# EAGLE design TM_Programmer0.1 (EAGLE 7.5.0)
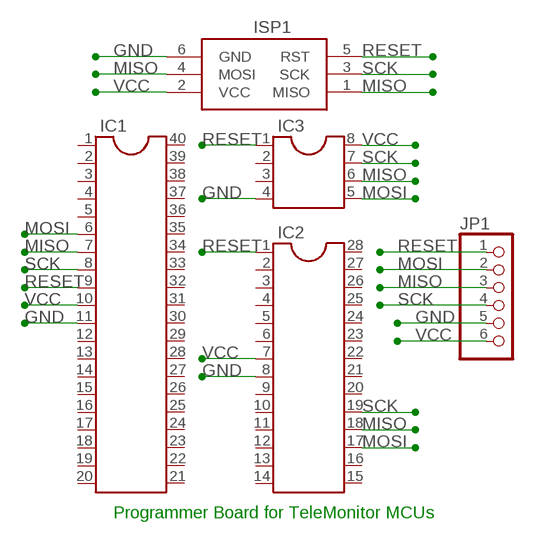
[diagram p0: schematic, sheet 1]

## Parts
IC1  DIL40  [DIL40]
IC2  DIL28-3  [DIL28-3]
IC3  DIL8S  [SOCKET-08]
ISP1  AVRISP-6  [AVRISP]
JP1  PINHD-1X6  [1X06]

## Nets
GND: IC1.11 IC2.8 IC3.4 ISP1.6(GND) JP1.5
MISO: IC1.7 IC2.18 IC3.6 ISP1.1(MISO) ISP1.4(MOSI) JP1.3
MOSI: IC1.6 IC2.17 IC3.5 JP1.2
RESET: IC1.9 IC2.1 IC3.1 ISP1.5(RST) JP1.1
SCK: IC1.8 IC2.19 IC3.7 ISP1.3(SCK) JP1.4
VCC: IC1.10 IC2.7 IC3.8 ISP1.2(VCC) JP1.6
Unconnected: IC1.1 IC1.2 IC1.3 IC1.4 IC1.5 IC1.12 IC1.13 IC1.14 IC1.15 IC1.16 IC1.17 IC1.18 IC1.19 IC1.20 IC1.21 IC1.22 IC1.23 IC1.24 IC1.25 IC1.26 IC1.27 IC1.28 IC1.29 IC1.30 IC1.31 IC1.32 IC1.33 IC1.34 IC1.35 IC1.36 IC1.37 IC1.38 IC1.39 IC1.40 IC2.2 IC2.3 IC2.4 IC2.5 IC2.6 IC2.9 IC2.10 IC2.11 IC2.12 IC2.13 IC2.14 IC2.15 IC2.16 IC2.20 IC2.21 IC2.22 IC2.23 IC2.24 IC2.25 IC2.26 IC2.27 IC2.28 IC3.2 IC3.3

## Notes on the sheet
- Programmer Board for TeleMonitor MCUs

## Library data of the parts
IC1 = ic-package:DIL40: Dual In Line
IC2 = ic-package:DIL28: Dual In Line
IC3 = ic-package:DIL8: Dual In Line / Socket
ISP1 = adafruit:AVRISP: AVR ISP HEADER Standard 6 pin header for AVR programming
JP1 = adafruit:PINHD-1X6: PIN HEADER

## Board
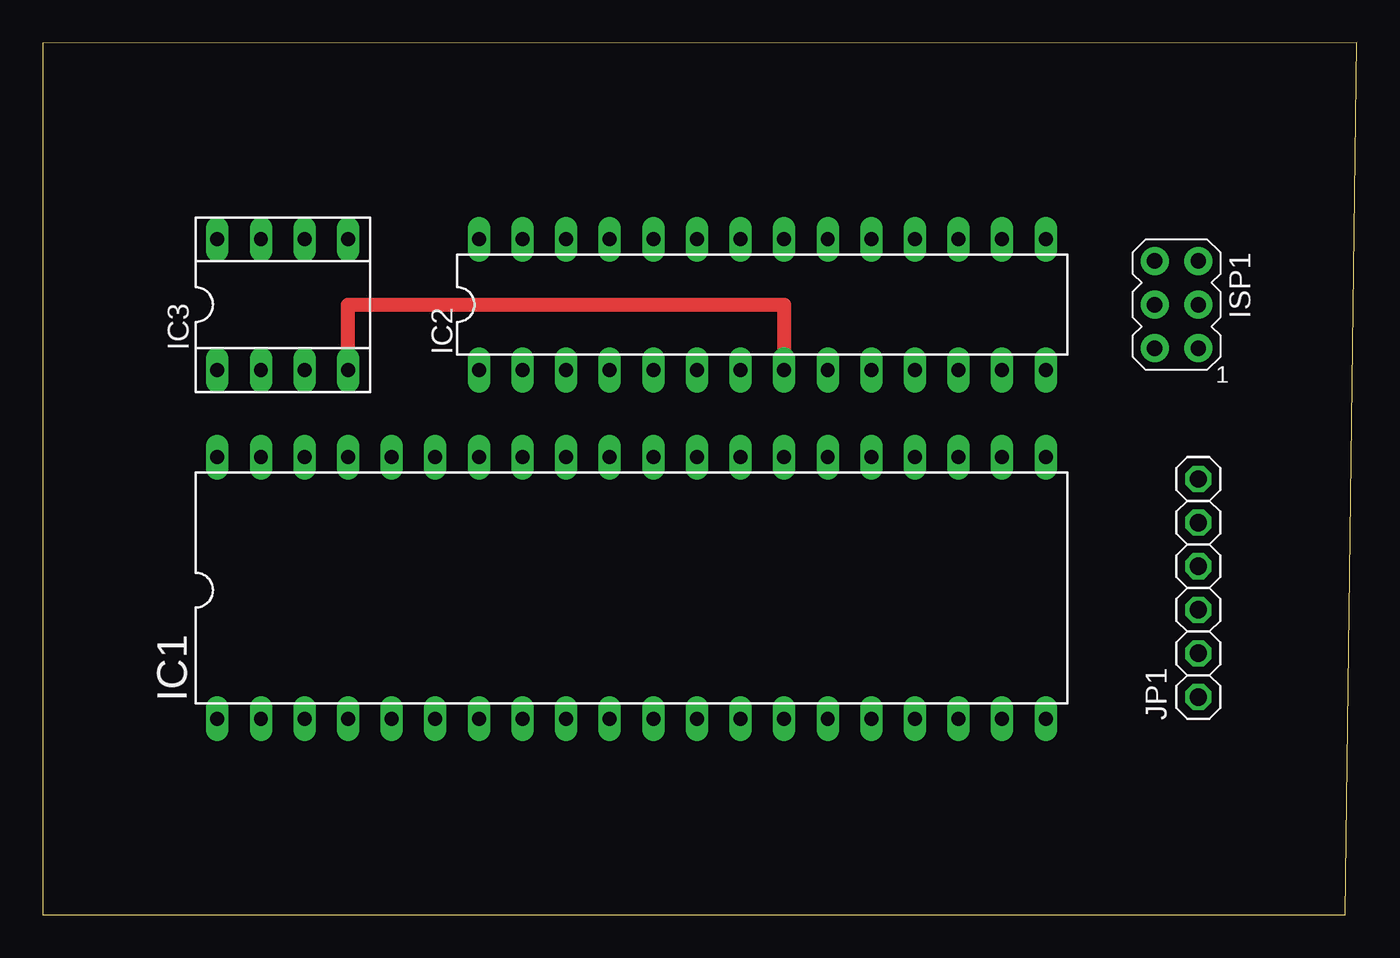
[diagram p1: board, top side]
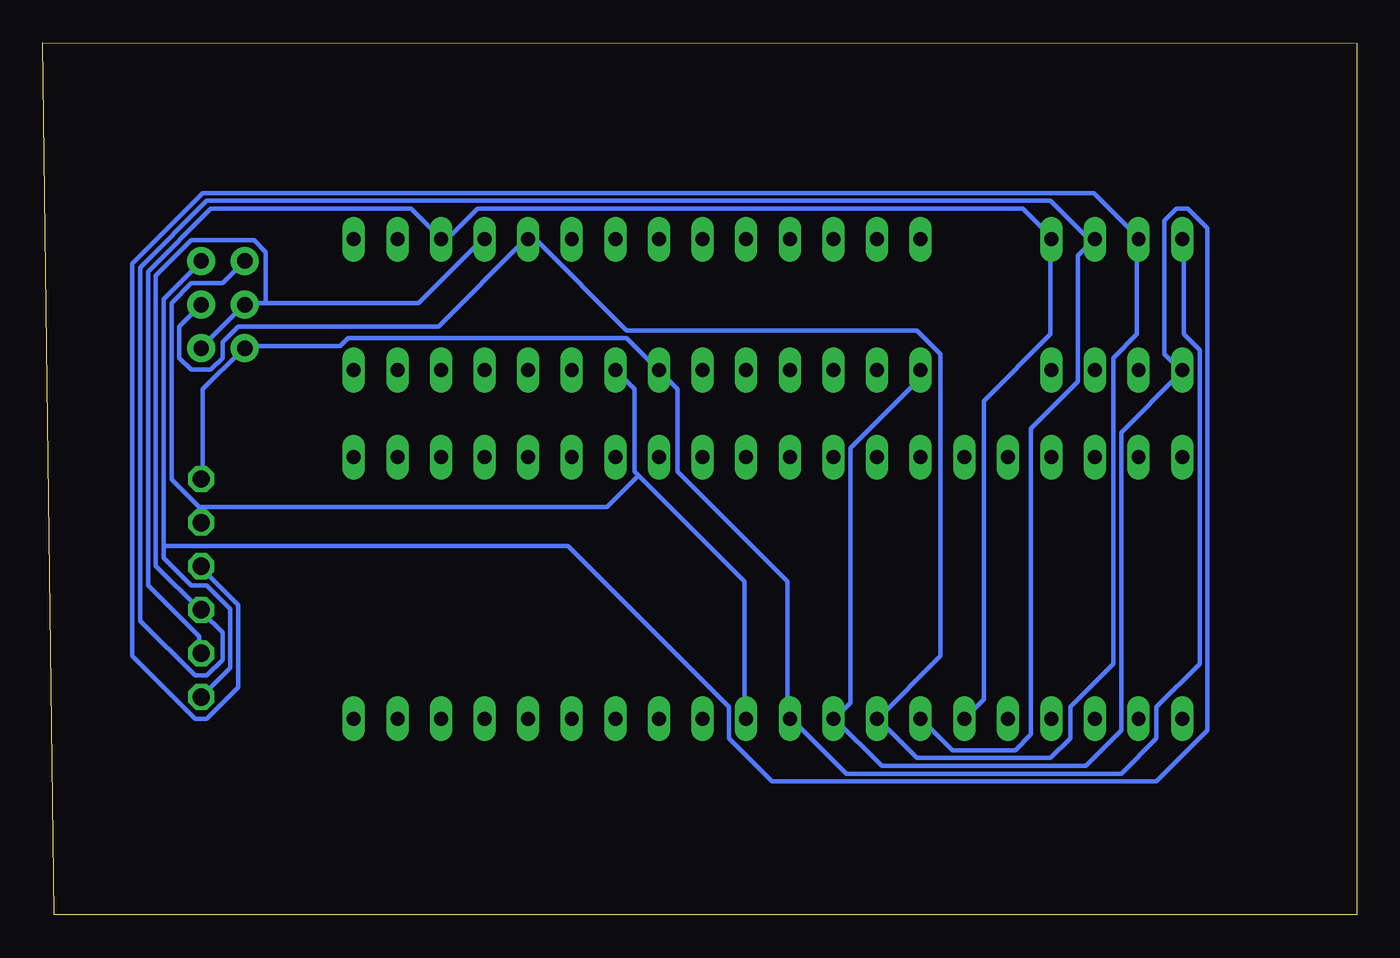
[diagram p2: board, bottom side, seen from below]

Size 76.53 x 50.81 mm. Coordinates in mm from the lower left corner, seen from the top.
Outline: 0,0 75.87,0 76.53,50.81 0,50.79 0,0
Copper layers (1*16): Top 0.035mm / dielectric 1.5mm / Bottom 0.035mm
Design rules "default": minimum track width 10mil, minimum drill 24mil, track to track 8mil, track to pad 8mil, pad to pad 8mil, via to via 8mil, smd to smd 8mil, copper to edge 40mil, drill to drill 8mil, minimum pad ring 10mil, minimum via ring 8mil, stop-mask expansion 4mil, vias tented up to drill 0mil, thermal gap 10mil

### Footprints (pad centres in the part's own frame; a part is rotated, then mirrored left to right if it is on the bottom)
DIL40 = drill 0.813 long: 1 -24.13,-7.62; 2 -21.59,-7.62; 3 -19.05,-7.62; 4 -16.51,-7.62; 5 -13.97,-7.62; 6 -11.43,-7.62; 7 -8.89,-7.62; 8 -6.35,-7.62; 9 -3.81,-7.62; 10 -1.27,-7.62; 11 1.27,-7.62; 12 3.81,-7.62; 13 6.35,-7.62; 14 8.89,-7.62; 15 11.43,-7.62; 16 13.97,-7.62; 17 16.51,-7.62; 18 19.05,-7.62; 19 21.59,-7.62; 20 24.13,-7.62; 21 24.13,7.62; 22 21.59,7.62; 23 19.05,7.62; 24 16.51,7.62; 25 13.97,7.62; 26 11.43,7.62; 27 8.89,7.62; 28 6.35,7.62; 29 3.81,7.62; 30 1.27,7.62; 31 -1.27,7.62; 32 -3.81,7.62; 33 -6.35,7.62; 34 -8.89,7.62; 35 -11.43,7.62; 36 -13.97,7.62; 37 -16.51,7.62; 38 -19.05,7.62; 39 -21.59,7.62; 40 -24.13,7.62
DIL28-3 = drill 0.813 long: 1 -16.51,-3.81; 2 -13.97,-3.81; 3 -11.43,-3.81; 4 -8.89,-3.81; 5 -6.35,-3.81; 6 -3.81,-3.81; 7 -1.27,-3.81; 8 1.27,-3.81; 9 3.81,-3.81; 10 6.35,-3.81; 11 8.89,-3.81; 12 11.43,-3.81; 13 13.97,-3.81; 14 16.51,-3.81; 15 16.51,3.81; 16 13.97,3.81; 17 11.43,3.81; 18 8.89,3.81; 19 6.35,3.81; 20 3.81,3.81; 21 1.27,3.81; 22 -1.27,3.81; 23 -3.81,3.81; 24 -6.35,3.81; 25 -8.89,3.81; 26 -11.43,3.81; 27 -13.97,3.81; 28 -16.51,3.81
SOCKET-08 = drill 0.813 long: 1 -3.81,-3.81; 2 -1.27,-3.81; 3 1.27,-3.81; 4 3.81,-3.81; 5 3.81,3.81; 6 1.27,3.81; 7 -1.27,3.81; 8 -3.81,3.81
AVRISP = drill 0.9 pad 1.626: 1 -1.27,2.54; 2 1.27,2.54; 3 -1.27,0; 4 1.27,0; 5 -1.27,-2.54; 6 1.27,-2.54
1X06 = drill 1.016 octagon: 1 -6.35,0; 2 -3.81,0; 3 -1.27,0; 4 1.27,0; 5 3.81,0; 6 6.35,0

### Placement (x,y rotation side)
IC1  34.29,19.05 0 top
IC2  41.91,35.56 0 top
IC3  13.97,35.56 0 top
ISP1  66.04,35.56 180 top
JP1  67.31,19.05 90 top

### Tracks (layer width: path | path; a pad name or v marks a point on that pad's centre or on a via)
GND
  Top 0.813: IC3.4 17.78,35.56 43.18,35.56 IC2.8
  Bottom 0.254: 67.44,23.77 67.44,22.86 JP1.5 | 67.44,23.77 69.04,25.38 69.04,35.66 67.89,36.8 66.06,36.8 ISP1.6 | 41.83,25.6 42.06,25.83 42.06,30.63 IC2.8 | 41.83,25.6 35.66,19.43 35.66,11.43 IC1.11 | 67.44,23.77 43.66,23.77 41.83,25.6
MISO
  Bottom 0.254: IC1.7 25.38,11.43 23.55,9.6 19.89,9.6 18.97,10.52 18.97,28.35 16.23,31.09 16.23,38.41 15.32,39.32 IC3.6 15.32,39.55 15.77,39.55 17.83,41.6 66.98,41.6 70.87,37.72 70.87,17.14 67.67,13.95 66.98,13.95 66.06,14.86 66.06,16.46 67.21,17.6 JP1.3 67.44,17.83 69.95,20.34 69.95,37.26 67.89,39.32 64.24,39.32 63.55,38.63 63.55,35.66 | 63.55,35.66 64.69,35.66 ISP1.4 64.92,35.43 67.21,33.15 ISP1.1 | 63.55,35.66 54.63,35.66 50.98,39.32 IC2.18
MOSI
  Bottom 0.254: IC1.6 21.72,12.57 21.72,29.95 17.83,33.83 17.83,39.32 IC3.5 17.83,39.55 19.43,41.15 51.21,41.15 52.81,39.55 53.26,39.55 IC2.17 53.49,39.55 55.09,41.15 66.75,41.15 70.41,37.49 70.41,19.2 67.44,16.23 67.44,15.32 JP1.2
RESET
  Bottom 0.254: JP1.1 65.61,14.4 65.61,17.83 66.98,19.2 67.89,19.2 69.49,20.8 69.49,21.49 | 69.49,21.49 69.49,35.89 67.44,37.95 ISP1.5 | 30.4,11.43 27.66,8.69 15.77,8.69 13.72,10.74 13.72,28.12 10.29,31.55 IC3.1 10.29,31.77 11.2,32.69 11.2,40.46 10.52,41.15 9.83,41.15 8.69,40.01 8.69,10.74 11.66,7.77 34.06,7.77 36.58,10.29 36.58,12.12 45.95,21.49 69.49,21.49 | 30.4,11.43 29.49,12.34 29.49,27.2 25.6,31.09 25.6,31.55 IC2.1 | 30.4,11.43 IC1.9
SCK
  Bottom 0.254: ISP1.3 68.58,34.29 68.58,32.46 67.89,31.77 66.75,31.77 66.06,32.46 66.06,33.38 65.15,34.29 53.49,34.29 48.46,39.32 IC2.19 48.23,39.32 47.78,39.32 42.52,34.06 25.6,34.06 24.23,32.69 24.23,15.09 27.89,11.43 | 27.89,11.43 25.6,9.14 17.83,9.14 16.69,10.29 16.69,12.12 14.17,14.63 14.17,32.46 12.8,33.83 12.8,39.32 IC3.7 12.8,39.55 15.32,42.06 67.21,42.06 71.32,37.95 71.32,15.09 67.67,11.43 66.98,11.43 65.15,13.26 65.15,18.06 67.21,20.12 JP1.4 | 27.89,11.43 IC1.8
VCC
  Bottom 0.254: JP1.6 67.21,25.6 67.21,30.63 64.92,32.92 ISP1.2 64.69,33.15 59.21,33.15 58.75,33.6 42.52,33.6 40.69,31.77 IC2.7 40.46,31.55 39.55,30.63 39.55,25.83 33.15,19.43 33.15,11.43 IC1.10 32.92,11.43 29.72,8.23 13.72,8.23 11.66,10.29 11.66,12.12 9.14,14.63 9.14,32.92 10.06,33.83 10.06,39.32 IC3.8